# EAGLE design mini-in-a-1 (EAGLE 9.6.2)
AUTHOR: Balazs Racz; DRAWING_TITLE: I/O daughterboard; LICENSE: Licensed by the Solderpad Hardware License V2.0; REVIEWER: n/a; REVISION: A; YEAR: 2023
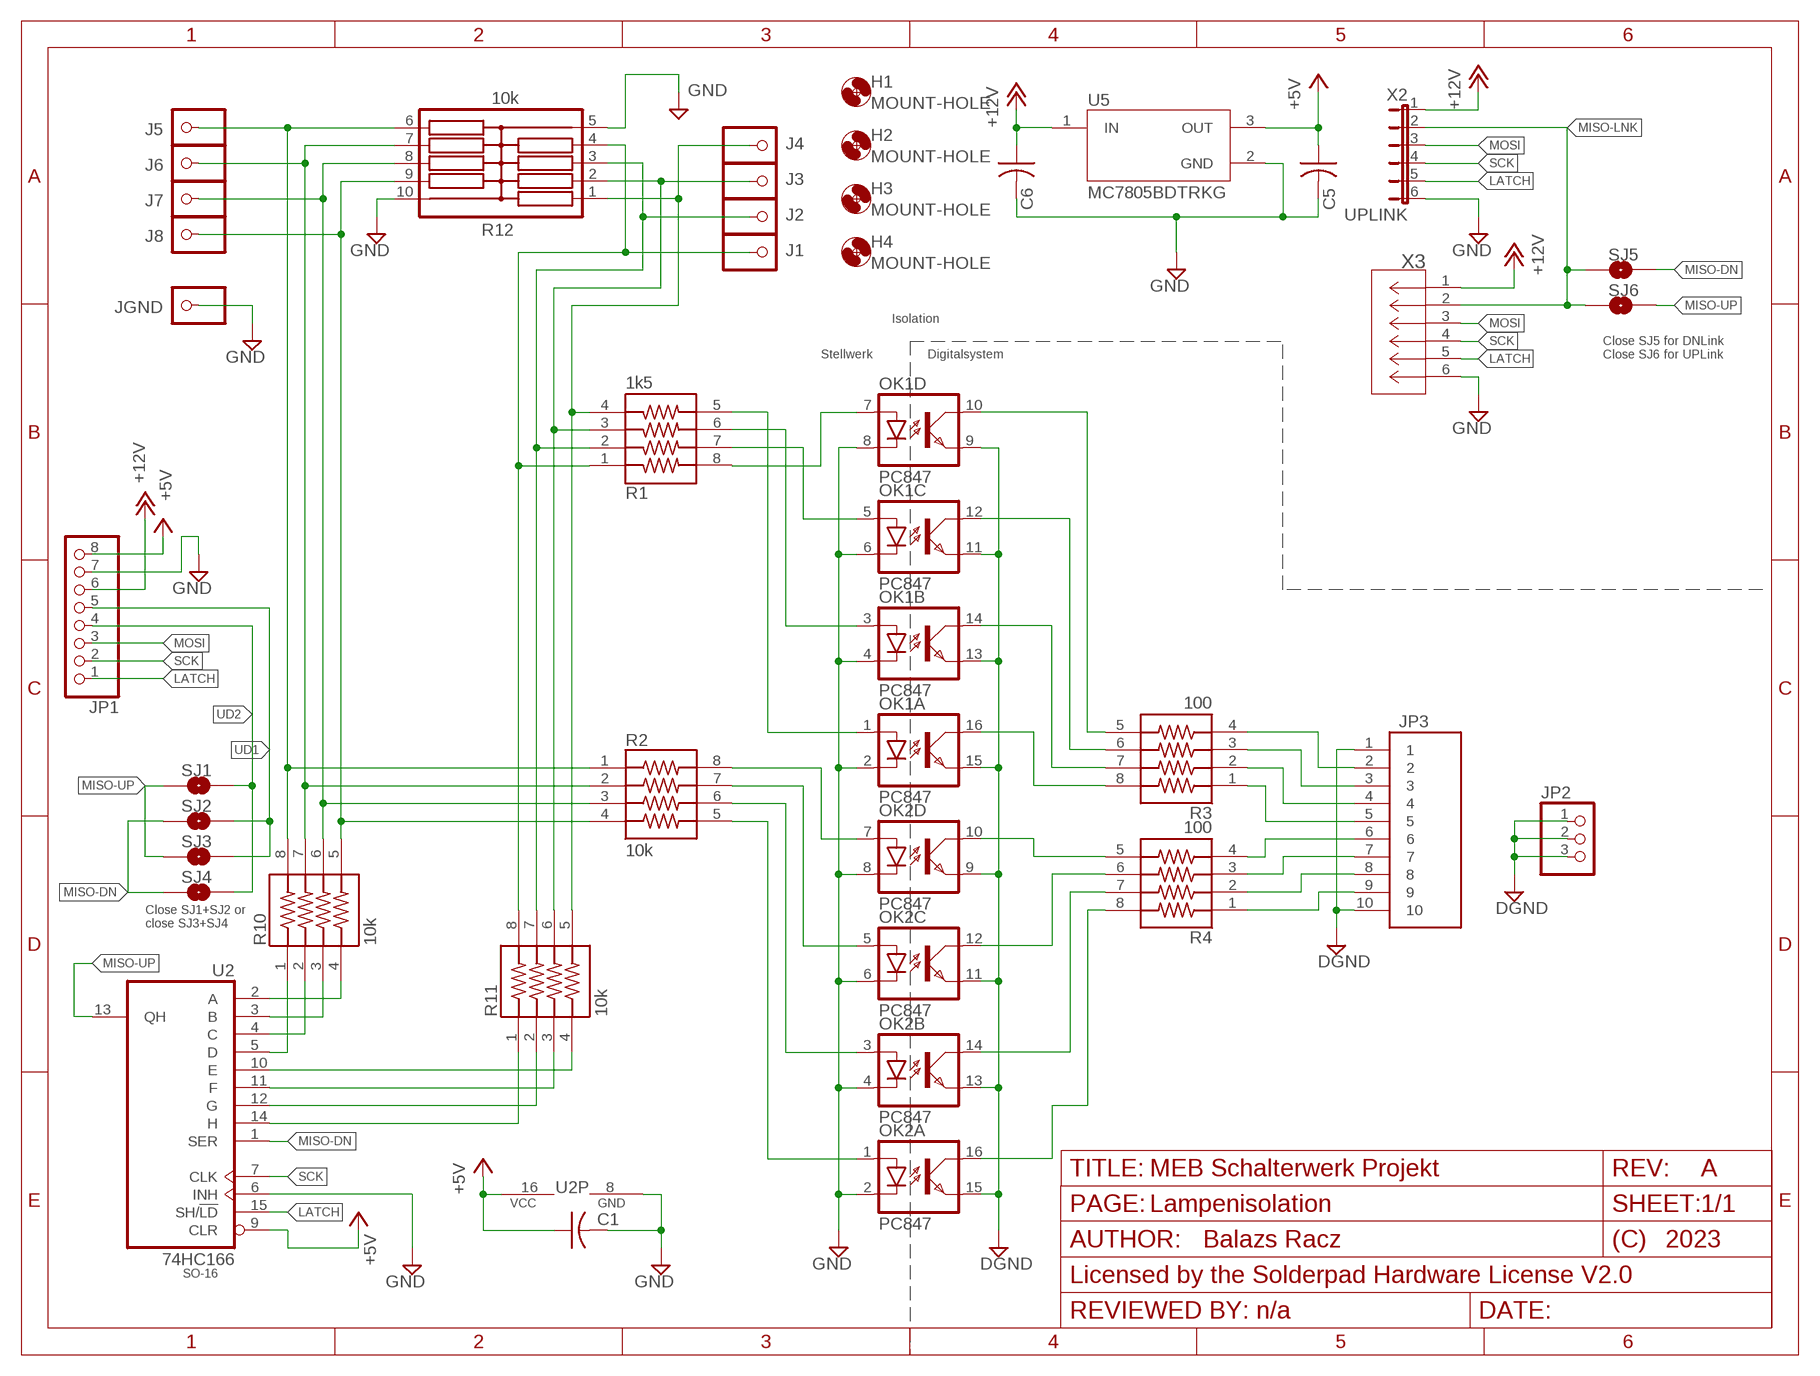
[diagram p0: schematic, sheet 1]
FRAME1 (FRAME_A_L): DRAWING_TITLE: MEB Schalterwerk Projekt; PAGE: Lampenisolation
FRAME2 (FRAME_A_L): PAGE: Input ports

## Parts
C1  C-USC0805  [C0805]
C5  C-USC0805  [C0805]
C6  C-USC0805  [C0805]
H1  MOUNT-HOLE  [MOUNT-HOLE-2,8]
H2  MOUNT-HOLE  [MOUNT-HOLE-2,8]
H3  MOUNT-HOLE  [MOUNT-HOLE-2,8]
H4  MOUNT-HOLE  [MOUNT-HOLE-2,8]
J1  LARGE-SOLDERPADWITH-HOLE  [LARGE-SOLDERPAD-WITH-HOLES]
J2  LARGE-SOLDERPADWITH-HOLE  [LARGE-SOLDERPAD-WITH-HOLES]
J3  LARGE-SOLDERPADWITH-HOLE  [LARGE-SOLDERPAD-WITH-HOLES]
J4  LARGE-SOLDERPADWITH-HOLE  [LARGE-SOLDERPAD-WITH-HOLES]
J5  LARGE-SOLDERPADWITH-HOLE  [LARGE-SOLDERPAD-WITH-HOLES]
J6  LARGE-SOLDERPADWITH-HOLE  [LARGE-SOLDERPAD-WITH-HOLES]
J7  LARGE-SOLDERPADWITH-HOLE  [LARGE-SOLDERPAD-WITH-HOLES]
J8  LARGE-SOLDERPADWITH-HOLE  [LARGE-SOLDERPAD-WITH-HOLES]
JGND  LARGE-SOLDERPADWITH-HOLE  [LARGE-SOLDERPAD-WITH-HOLES]
JP1  PINHD-1X8  [1X08]
JP2  PINHD-1X3  [1X03]
JP3  TE-CON-MTA150-RA-HEADER-1-640457-0  [TE_1-640457-0]
OK1  PC847  [DIL16]
OK2  PC847  [DIL16]
R1  1k5  RES-NET-YC324-JK-0710KL  [RESCAXS127P508X320X70-8N]
R2  10k  RES-NET-YC324-JK-0710KL  [RESCAXS127P508X320X70-8N]
R3  100  RES-NET-YC324-JK-0710KL  [RESCAXS127P508X320X70-8N]
R4  100  RES-NET-YC324-JK-0710KL  [RESCAXS127P508X320X70-8N]
R10  10k  RES-NET-YC324-JK-0710KL  [RESCAXS127P508X320X70-8N]
R11  10k  RES-NET-YC324-JK-0710KL  [RESCAXS127P508X320X70-8N]
R12  10k  RES-NET-745C101103JP  [RESCAV127P640X310X70-10N]
SJ1  SJRND2  [SJ_RND2]
SJ2  SJRND2  [SJ_RND2]
SJ3  SJRND2  [SJ_RND2]
SJ4  SJRND2  [SJ_RND2]
SJ5  SJRND2  [SJ_RND2]
SJ6  SJRND2  [SJ_RND2]
U2  74HC166  74166D  [SO16]
U5  MC7805BDTRKG  [DPAK229P990X238-4N]
X2  UPLINK  JP6-FLATFEMALE  [JP6F-FEM]
X3  MOLEX_530480610CON_530480610_MOL  [CON_530480610_MOL]

## Nets
+5V: C1.1 C5.1 JP1.8 U2.9(CLR) U2.16(VCC) U5.3(OUT)
+12V: C6.1 JP1.6 U5.1(IN) X2.1 X3.1
DGND: JP2.1 JP2.2 JP2.3 JP3.1 JP3.10 OK1.9(D:EMIT) OK1.11(C:EMIT) OK1.13(B:EMIT) OK1.15(A:EMIT) OK2.9(D:EMIT) OK2.11(C:EMIT) OK2.13(B:EMIT) OK2.15(A:EMIT)
GND: C1.2 C5.2 C6.2 JGND.P$1 JP1.7 OK1.2(A:C) OK1.4(B:C) OK1.6(C:C) OK1.8(D:C) OK2.2(A:C) OK2.4(B:C) OK2.6(C:C) OK2.8(D:C) R12.5 R12.10 U2.6(INH) U2.8(GND) U5.2(GND) X2.6 X3.6
LATCH: JP1.1 U2.15(SH/!LD) X2.5 X3.5
MISO-DN: SJ2.P$1 SJ4.P$1 SJ5.P$1 U2.1(SER)
MISO-LNK: SJ5.P$2 SJ6.P$2 X2.2 X3.2
MISO-UP: SJ1.P$1 SJ3.P$1 SJ6.P$1 U2.13(QH)
MOSI: JP1.3 X2.3 X3.3
N$1: J1.P$1 R1.1 R11.8 R12.4
N$2: J2.P$1 R1.2 R11.7 R12.3
N$3: J3.P$1 R1.3 R11.6 R12.2
N$4: J4.P$1 R1.4 R11.5 R12.1
N$5: J5.P$1 R2.1 R10.8 R12.6
N$6: J6.P$1 R2.2 R10.7 R12.7
N$7: J7.P$1 R2.3 R10.6 R12.8
N$8: J8.P$1 R2.4 R10.5 R12.9
N$9: OK1.7(D:A) R1.8
N$10: OK1.5(C:A) R1.7
N$11: OK1.3(B:A) R1.6
N$12: OK1.1(A:A) R1.5
N$15: JP3.2 R3.4
N$16: JP3.3 R3.3
N$17: JP3.4 R3.2
N$18: JP3.5 R3.1
N$19: JP3.6 R4.4
N$20: JP3.7 R4.3
N$21: JP3.8 R4.2
N$22: JP3.9 R4.1
N$23: OK1.10(D:COL) R3.5
N$24: OK1.12(C:COL) R3.6
N$25: OK1.14(B:COL) R3.7
N$26: OK1.16(A:COL) R3.8
N$27: OK2.10(D:COL) R4.5
N$28: OK2.12(C:COL) R4.6
N$29: OK2.14(B:COL) R4.7
N$30: OK2.16(A:COL) R4.8
N$31: OK2.7(D:A) R2.8
N$32: OK2.5(C:A) R2.7
N$33: OK2.3(B:A) R2.6
N$34: OK2.1(A:A) R2.5
QA: R10.4 U2.2(A)
QB: R10.3 U2.3(B)
QC: R10.2 U2.4(C)
QD: R10.1 U2.5(D)
QE: R11.4 U2.10(E)
QF: R11.3 U2.11(F)
QG: R11.2 U2.12(G)
QH: R11.1 U2.14(H)
SCK: JP1.2 U2.7(CLK) X2.4 X3.4
UD1: JP1.5 SJ2.P$2 SJ3.P$2
UD2: JP1.4 SJ1.P$2 SJ4.P$2

## Notes on the sheet
- Isolation
- Stellwerk | Digitalsystem
- Close SJ5 for DNLink
  Close SJ6 for UPLink
- Close SJ1+SJ2 or
  close SJ3+SJ4
- SO-16

## Library data of the parts
C1 C5 C6 = rcl:C-US: CAPACITOR, American symbol; SPICEPREFIX: C
H1-H4 = eagleparts:MOUNT-HOLE
J1-J8 JGND = eagleparts:LARGE-SOLDERPAD
JP1 = pinhead:PINHD-1X8: PIN HEADER
JP2 = pinhead:PINHD-1X3: PIN HEADER
JP3 = eagleparts:TE-CON-MTA150-RA-HEADER-1-640457-0: Connector Header Through Hole, Right Angle 10 position 0.100" (2.54mm) A1930-ND TE Connectivity AMP 1-640457-0; MANUFACTURER: TE; PARTREV: R; STANDARD: Manufacturer Recommendations
OK1 OK2 = optocoupler:PC847: SHARP OPTO COUPLER; OC_FARNELL: 9707735; OC_NEWARK: unknown
R1-R4 R10 R11 = eagleparts:RES-NET-YC324-JK-0710KL; MANUFACTURER: Yageo; MAXIMUM_PACKAGE_HEIGHT: 0.7 mm; PARTREV: V.9; SNAPEDA_PACKAGE_ID: 22941; STANDARD: IPC 7351B
R12 = eagleparts:RES-NET-745C101103JP: Res Thick Film Array 1K Ohm 5% 1/2W Â±200ppm/Â°C BUS Molded 10-Pin 2512 Concave SMD Plastic T/R; MANUFACTURER: CTS; PARTREV: K; STANDARD: IPC-7351B
SJ1-SJ6 = eagleparts:SJ: SMD solder JUMPER
U2 = trainlib:74*166: 8-bit parallel load SHIFT REGISTER
U5 = MC7805BDTRKG:MC7805BDTRKG: Linear Voltage Regulator, Positive, 5.0 V, 1.0 A Vout: 5.0 V; TJ = -40°C to +125°C; MANUFACTURER: ON Semiconductor; PARTREV: 27; STANDARD: IPC-7351B
X2 = eagleparts:JP6-FLAT
X3 = eagleparts:MOLEX_530480610: Right-angle 6-pin 1.25mm male molex connector. WM1746-ND https://www.digikey.com/en/products/detail/molex/0530480610/242868; COPYRIGHT: Copyright (C) 2023 Ultra Librarian. All rights reserved.; MANUFACTURER_PART_NUMBER: 530480610; MFR_NAME: Molex Connector Corporation

## Board
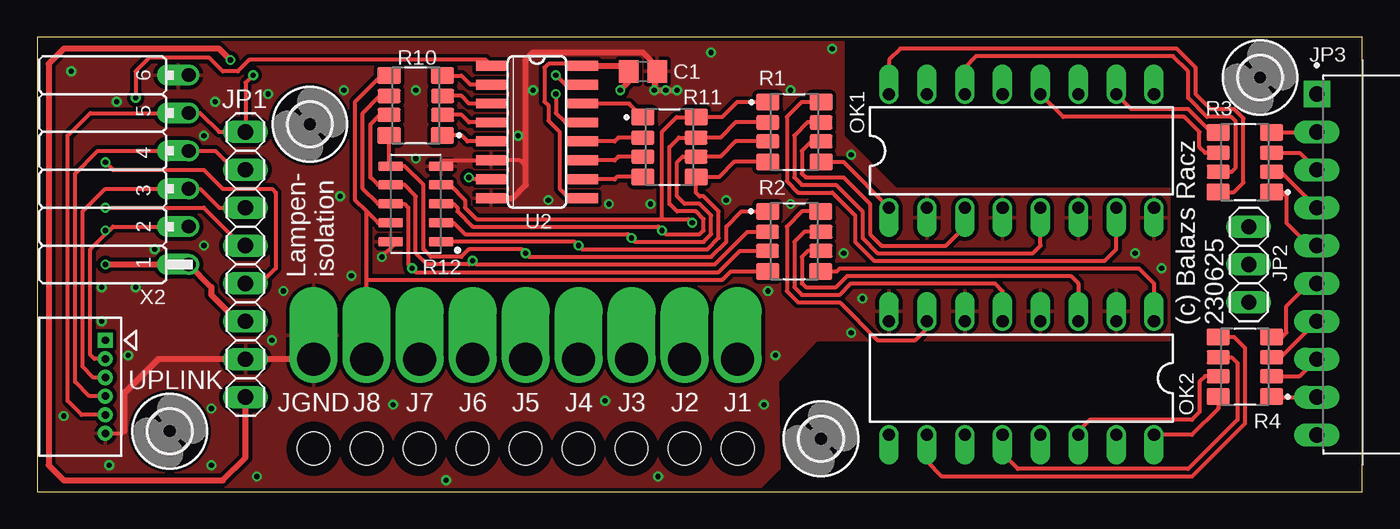
[diagram p1: board, top side]
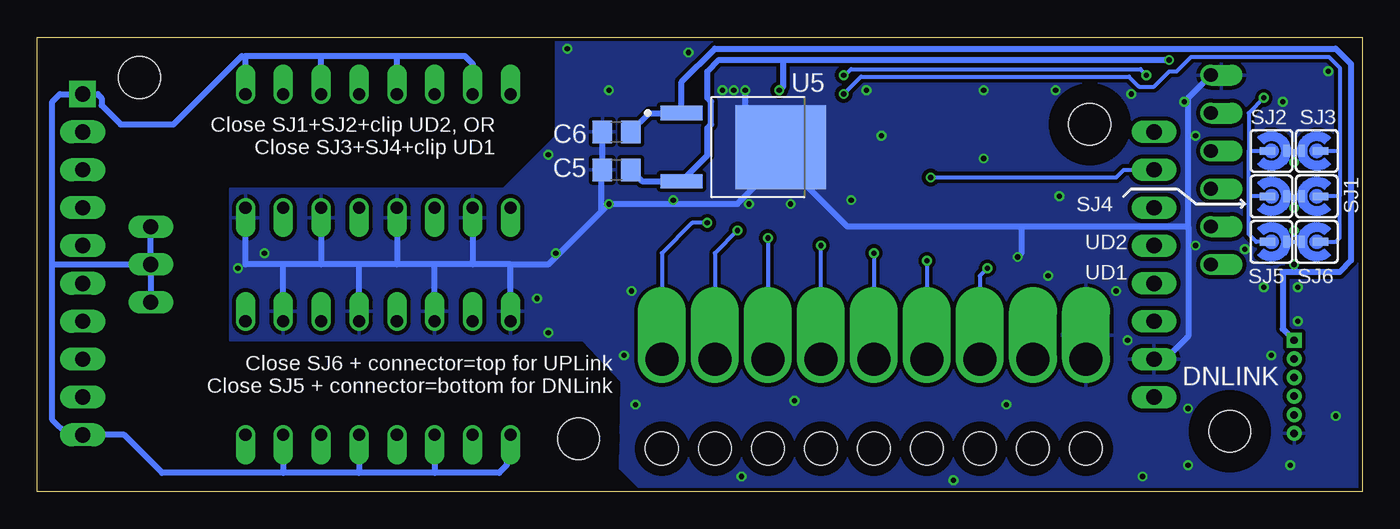
[diagram p2: board, bottom side, seen from below]

Size 88.9 x 30.48 mm. Coordinates in mm from the lower left corner, seen from the top.
Outline: 0,0 88.9,0 88.9,30.48 0,30.47 0,0
Copper layers (1*16): Top 0.035mm / dielectric 1.5mm / Bottom 0.035mm
Design rules "SeeedStudio_2layer_DRU_no_angle_20140221": minimum track width 6mil, minimum drill 12mil, track to track 6mil, track to pad 6mil, pad to pad 6mil, via to via 6mil, smd to smd 0mil, copper to edge 10mil, drill to drill 10mil, minimum pad ring 10mil, minimum via ring 6mil, stop-mask expansion 2mil, vias tented up to drill 100mil, thermal gap 10mil

### Footprints (pad centres in the part's own frame; a part is rotated, then mirrored left to right if it is on the bottom)
C0805 = smd 1.3 x 1.5: 1 -0.95,0; 2 0.95,0
MOUNT-HOLE-2,8 = hole 2.8: 0,0
LARGE-SOLDERPAD-WITH-HOLES = drill 2.2 pad 3 offset: P$1 0,0 | hole 2.2: 0,-6
1X08 = drill 1.016 long: 1 -8.89,0; 2 -6.35,0; 3 -3.81,0; 4 -1.27,0; 5 1.27,0; 6 3.81,0; 7 6.35,0; 8 8.89,0
1X03 = drill 1.016 long: 1 -2.54,0; 2 0,0; 3 2.54,0
TE_1-640457-0 = drill 1.02 pad 1.778 square: 1 -11.43,0 | drill 1.02 pad 1.37 long: 2 -8.89,0; 3 -6.35,0; 4 -3.81,0; 5 -1.27,0; 6 1.27,0; 7 3.81,0; 8 6.35,0; 9 8.89,0; 10 11.43,0
DIL16 = drill 0.813 offset: 1 -8.89,-3.81; 2 -6.35,-3.81; 3 -3.81,-3.81; 4 -1.27,-3.81; 5 1.27,-3.81; 6 3.81,-3.81; 7 6.35,-3.81; 8 8.89,-3.81; 9 8.89,3.81; 10 6.35,3.81; 11 3.81,3.81; 12 1.27,3.81; 13 -1.27,3.81; 14 -3.81,3.81; 15 -6.35,3.81; 16 -8.89,3.81
RESCAXS127P508X320X70-8N = smd 1.54 x 1.13: 1 -1.79,2.005; 4 -1.79,-2.005; 5 1.79,-2.005; 8 1.79,2.005 | smd 1.54 x 0.93: 2 -1.79,0.635; 3 -1.79,-0.635; 6 1.79,-0.635; 7 1.79,0.635
RESCAV127P640X310X70-10N = smd 1.63 x 0.63: 1 -1.695,2.54; 2 -1.695,1.27; 3 -1.695,0; 4 -1.695,-1.27; 5 -1.695,-2.54; 6 1.695,-2.54; 7 1.695,-1.27; 8 1.695,0; 9 1.695,1.27; 10 1.695,2.54
SJ_RND2 = smd 1.016 x 0.508: P$1 -0.254,0 | smd 0.406 x 0.813: P$2 1.016,0
SO16 = smd 0.66 x 2.032: 1 -4.445,-3.073; 2 -3.175,-3.073; 3 -1.905,-3.073; 4 -0.635,-3.073; 5 0.635,-3.073; 6 1.905,-3.073; 7 3.175,-3.073; 8 4.445,-3.073; 9 4.445,3.073; 10 3.175,3.073; 11 1.905,3.073; 12 0.635,3.073; 13 -0.635,3.073; 14 -1.905,3.073; 15 -3.175,3.073; 16 -4.445,3.073
DPAK229P990X238-4N = smd 0.97 x 2.83: 1 -2.29,-4.14; 3 2.29,-4.14 | smd 5.63 x 6.09: 2 0,2.51
JP6F-FEM = drill 0.914 offset: 1 -8.89,0; 2 -6.35,0; 3 -3.81,0; 4 -1.27,0; 5 1.27,0; 6 3.81,0
CON_530480610_MOL = drill 0.5 pad 0.85 square: 1 0,0 | drill 0.5 pad 0.85: 2 1.25,0; 3 2.5,0; 4 3.75,0; 5 5,0; 6 6.25,0

### Placement (x,y rotation side)
C1  40.64,28.19 0 top
C5  50.04,21.59 180 bottom
C6  50.04,24.13 180 bottom
H1  52.58,3.56 0 top
H2  82.04,27.79 0 top
H3  18.29,24.64 0 top
H4  8.89,4.06 0 top
J1  46.99,8.89 0 top
J2  43.43,8.89 0 top
J3  39.88,8.89 0 top
J4  36.32,8.89 0 top
J5  32.77,8.89 0 top
J6  29.21,8.89 0 top
J7  25.65,8.89 0 top
J8  22.1,8.89 0 top
JGND  18.54,8.89 0 top
JP1  13.97,15.24 270 top
JP2  81.28,15.24 270 top
JP3  85.85,15.24 270 top
OK1  66.04,22.86 0 top
OK2  66.04,7.62 180 top
R1  50.8,24.13 0 top
R2  50.79,16.79 0 top
R3  81.03,22.1 180 top
R4  81.03,8.38 180 top
R10  25.4,25.91 180 top
R11  42.42,23.11 0 top
R12  25.4,19.3 180 top
SJ1  3.05,19.81 180 bottom
SJ2  6.1,22.86 0 bottom
SJ3  3.05,22.86 180 bottom
SJ4  6.1,19.81 0 bottom
SJ5  6.1,16.76 0 bottom
SJ6  3.05,16.76 180 bottom
U2  33.53,24.13 270 top
U5  41.53,23.11 270 bottom
X2  10.16,24.13 90 top
X3  4.57,10.16 270 top

### Tracks (layer width: path | path; a pad name or v marks a point on that pad's centre or on a via)
+5V  (via drill 0.35)
  Top 0.254: U2.16 35.69,28.57 35.56,28.7 34.29,28.7 34.04,28.45 34.04,26.16 34.29,25.91 34.29,24.89 35.05,24.13 35.05,20.32 35.69,19.68 U2.9
  Top 0.406: U2.16 39.31,28.57 39.62,28.26 | 39.62,28.26 C1.1 | v39.12,26.92 39.62,27.43 39.62,28.26 | v12.95,28.96 12.19,29.72 1.78,29.72 0.76,28.7 0.76,1.78 1.78,0.76 12.45,0.76 13.97,2.29 JP1.8
  Bottom 0.406: C5.1 48.33,20.83 U5.3 43.94,22.55 43.94,24.38 43.69,24.64 43.69,26.16 43.94,26.42 43.94,28.19 43.18,28.96 38.86,28.96 | 38.86,28.96 38.86,27.18 v39.12,26.92 | 38.86,28.96 v12.95,28.96
+12V  (via drill 0.35)
  Top 0.254: X2.1 9.91,15.24 | v4.57,15.24
  Top 0.406: v4.57,15.24 9.91,15.24 X2.1 11.68,13.72 11.68,13.21 13.46,11.43 JP1.6
  Bottom 0.254: v4.57,15.24 4.57,14.99
  Bottom 0.406: C6.1 47.82,25.4 U5.1 45.67,27.48 43.43,29.72 1.78,29.72 0.76,28.7 0.76,15.49 1.52,14.73 4.57,14.73 | 4.57,14.99 4.57,14.73 | X3.1 5.33,10.92 5.33,14.73 4.57,14.73
DGND
  Bottom 0.406: OK2.9 57.4,3.56 57.4,1.78 57.91,1.27 62.23,1.27 | 62.23,1.27 67.31,1.27 | 67.31,1.27 72.39,1.27 | 72.39,1.27 80.52,1.27 83.06,3.81 JP3.10 86.87,3.81 87.88,4.83 87.88,15.24 | OK2.15 72.39,1.27 | OK2.13 67.31,1.27 | OK2.11 62.23,1.27 | 87.88,15.24 87.88,26.16 87.38,26.67 JP3.1 84.84,26.67 84.75,26.58 84.75,26.57 84.58,26.4 84.58,25.91 83.31,24.64 79.76,24.64 75.18,29.21 74.93,29.21 | OK1.15 59.69,28.7 60.2,29.21 64.77,29.21 | 64.77,29.21 69.85,29.21 | 69.85,29.21 74.93,29.21 | OK1.13 64.77,29.21 | OK1.11 69.85,29.21 | OK1.9 74.93,29.21 | 87.88,15.24 JP2.2 | JP2.2 JP2.1 | JP2.2 JP2.3
GND  (via drill 0.35)
  Top 0.254: R12.5 27.28,22.23 U2.6 32.38,22.23 32.77,21.84 32.77,20.57 | X3.6 5.69,3.91 5.84,4.06 | R12.10 23.9,16.54 v23.11,15.75
  Top 0.406: U2.8 31.88,19.68 32.77,20.57 32.77,28.96 33.27,29.46 40.64,29.46 41.59,28.51 C1.2 41.4,28.01 v41.4,26.92 v42.16,26.92 v42.93,26.92 | JGND.P$1 JP1.7 8.13,8.89 5.84,6.6 5.84,4.06
  Bottom 0.254: v41.4,26.92
  Bottom 0.406: OK2.8 57.15,15.24 | 57.15,15.24 59.69,15.24 | 59.69,15.24 62.23,15.24 | 62.23,15.24 64.77,15.24 | 64.77,15.24 67.31,15.24 | 67.31,15.24 69.85,15.24 | 69.85,15.24 72.39,15.24 | 72.39,15.24 74.93,15.24 OK1.8 | OK1.6 69.85,15.24 | OK2.2 72.39,15.24 | OK1.4 64.77,15.24 | OK2.6 62.23,15.24 | OK2.4 67.31,15.24 | OK1.2 59.69,15.24 | 57.15,15.24 54.61,15.24 51.05,18.8 | 51.05,18.8 51.05,21.52 C5.2 C6.2 | 51.05,18.8 v50.55,19.3 41.91,19.3 39.02,22.2 39.02,22.25 | v41.4,26.92 41.4,25.5 U5.2 39.02,22.25 | X2.6 11.68,26.42 11.68,17.78 | 11.68,17.78 22.86,17.78 | 22.86,17.78 34.54,17.78 39.02,22.25 | 22.86,17.78 22.86,16 v23.11,15.75 | JP1.7 13.21,8.89 11.68,10.41 11.68,17.78
  other vias: 20.32,19.81 21.08,14.48 16.51,13.46 15.75,10.16 6.6,13.72 6.1,9.14 11.68,5.59 11.68,1.78 14.73,1.02 27.43,0.76 41.66,1.02 48.77,5.84 49.53,9.14 54.61,10.67 55.37,12.95 54.1,16 49.02,13.46 46.23,19.56 38.35,19.3 41.15,19.3 34.29,19.56 32.26,23.88 33.27,26.92 45.21,29.46 50.55,26.92 53.34,29.72 54.61,22.61 73.66,16 75.44,14.99 2.29,28.19 5.33,26.16 11.94,26.16 11.18,23.88 11.18,16.51 7.87,16.26 1.78,5.08 4.83,1.78 25.4,22.35 25.4,26.92 20.57,26.92 15.49,26.67 38.1,6.1 23.88,5.84 4.32,13.72 4.32,11.43
  pour Top (isolate 0.254): 0.25,30.23 0.25,0.25 48.51,0.25 49.78,1.52 49.7,7.38 52.32,10.16 75.95,10.16 75.95,20.32 57.66,20.32 54.1,23.88 54.1,30.23
  pour Bottom (isolate 0.254): 0.25,30.23 0.25,0.25 48.51,0.25 49.78,1.52 49.7,7.38 52.32,10.16 75.95,10.16 75.95,20.32 57.66,20.32 54.1,23.88 54.1,30.23
  pour Bottom (rank 2, no thermals): 35.56,26.67 35.56,26.16 35.05,25.65 35.05,19.81 42.67,19.81 42.67,26.42 39.62,26.42 39.37,26.16 38.86,26.16 38.61,26.42 38.35,26.67
LATCH  (via drill 0.35)
  Top 0.254: X3.5 2.97,5.16 2.03,6.1 2.03,23.88 3.56,25.4 X2.5 10.92,25.4 12.19,24.13 JP1.1 13.97,27.43 v14.48,27.94 | U2.15 35.43,27.3 v34.8,27.94
  Bottom 0.254: v34.8,27.94 34.7,27.94 34.29,28.35 14.88,28.35 v14.48,27.94
MISO-DN  (via drill 0.35)
  Top 0.254: U2.1 30.07,28.96 14.22,28.96 13.46,28.19 12.45,28.19 11.53,29.11 7.52,29.11 6.6,28.19 v6.6,26.42
  Bottom 0.254: SJ5.P$1 7.11,16.76 7.62,17.27 7.62,19.81 | 7.62,19.81 7.62,22.86 | 7.62,22.86 SJ2.P$1 | SJ4.P$1 7.62,19.81 | v6.6,26.42 7.62,25.4 7.62,22.86
MISO-LNK  (via drill 0.35)
  Top 0.254: X3.2 3.83,8.91 3.56,9.18 3.56,16.26 4.57,17.27 | X2.2 5.08,17.78 4.57,17.27 | v4.57,17.53 4.57,17.27
  Bottom 0.254: SJ5.P$2 SJ6.P$2 4.57,17.27 v4.57,17.53
MISO-UP  (via drill 0.35)
  Top 0.254: U2.13 35.43,24.77 34.8,25.4 v34.8,26.67
  Bottom 0.254: SJ6.P$1 1.78,16.76 1.52,17.02 1.52,19.81 | 1.52,22.86 1.52,19.81 | v34.8,26.67 33.63,27.84 15.65,27.84 14.99,27.18 13.97,27.18 12.95,28.19 12.45,28.19 11.48,29.16 2.23,29.16 1.52,28.45 1.52,22.86 | 1.52,19.81 SJ1.P$1 | SJ3.P$1 1.52,22.86
MOSI
  Top 0.254: JP1.3 12.19,19.05 10.92,20.32 X2.3 4.57,20.32 3.05,18.8 3.05,8.38 3.77,7.66 X3.3
N$1  (via drill 0.35)
  Top 0.254: R12.4 27.69,20.57 28.7,19.56 28.7,19.05 29.46,18.29 41.91,18.29 | v43.94,18.03 43.69,18.29 41.91,18.29 | 41.91,18.29 41.91,24.13 42.9,25.12 R11.8 45.95,25.12 46.96,26.14 R1.1
  Bottom 0.254: v43.94,18.03 44.96,18.03 46.99,16 J1.P$1
N$2  (via drill 0.35)
  Top 0.254: R12.3 27.94,19.3 28.19,19.05 28.19,18.8 29.21,17.78 41.66,17.78 v41.91,17.53 42.16,17.27 44.45,17.27 44.7,17.53 44.7,18.29 44.2,18.8 42.93,18.8 42.42,19.3 42.42,23.11 43.05,23.75 R11.7 45.85,23.75 46.86,24.77 R1.2
  Bottom 0.254: v41.91,17.53 43.43,16 J2.P$1
N$3  (via drill 0.35)
  Top 0.254: R12.2 27.94,18.03 28.7,17.27 39.62,17.27 v39.88,17.02 40.13,16.76 44.7,16.76 45.21,17.27 45.21,18.54 44.45,19.3 43.43,19.3 42.93,19.81 42.93,22.1 43.31,22.48 R11.6 45.85,22.48 46.86,23.5 R1.3
  Bottom 0.254: v39.88,17.02 J3.P$1
N$4  (via drill 0.35)
  Top 0.254: R12.1 36.07,16.76 v36.32,16.51 36.58,16.26 44.96,16.26 45.72,17.02 45.72,18.8 44.7,19.81 44.45,19.81 44.2,20.07 44.2,21.1 | 44.2,21.1 R11.5 | R1.4 46.76,22.12 45.73,21.1 44.2,21.1
  Bottom 0.254: J4.P$1 v36.32,16.51
N$5  (via drill 0.35)
  Top 0.254: R10.8 23.61,22.14 R12.6 24.64,21.84 25.91,20.57 25.91,16.26 26.42,15.75 28.45,15.75 28.96,16.26 32.51,16.26 v32.77,16 33.02,15.75 45.21,15.75 46.23,16.76 46.23,17.78 47.24,18.8 R2.1
  Bottom 0.254: v32.77,16 J5.P$1
N$6  (via drill 0.35)
  Top 0.254: R10.7 22.99,25.27 22.35,24.64 22.35,21.08 22.86,20.57 R12.7 24.64,20.57 25.4,19.81 25.4,16 26.16,15.24 28.96,15.24 v29.21,15.49 29.46,15.24 45.47,15.24 47.65,17.43 R2.2
  Bottom 0.254: v29.21,15.49 J6.P$1
N$7  (via drill 0.35)
  Top 0.254: R10.6 22.99,26.54 21.84,25.4 21.84,20.32 22.86,19.3 R12.8 24.64,19.3 24.89,19.05 24.89,15.24 v25.15,14.99 25.4,14.73 45.72,14.73 47.14,16.16 R2.3
  Bottom 0.254: v25.15,14.99 25.65,14.48 J7.P$1
N$8
  Top 0.254: J8.P$1 22.1,14.22 | 22.1,14.22 22.1,18.8 | R12.9 22.86,18.03 22.1,18.8 | 22.1,18.8 21.34,19.56 21.34,26.16 23.09,27.91 R10.5 | 22.1,14.22 45.97,14.22 46.54,14.79 R2.4
N$9
  Top 0.254: R1.8 51.28,26.14 50.29,25.15 50.29,20.83 51.05,20.07 53.34,20.07 54.86,18.54 54.86,16.76 56.13,15.49 71.63,15.49 72.39,16.26 OK1.7
N$10
  Top 0.254: R1.7 51.69,24.77 50.8,23.88 50.8,21.08 51.31,20.57 53.59,20.57 55.37,18.8 55.37,17.02 56.39,16 66.8,16 67.31,16.51 OK1.5
N$11
  Top 0.254: R1.6 51.94,23.5 51.31,22.86 51.31,21.34 51.56,21.08 54.1,21.08 55.88,19.3 55.88,17.27 56.64,16.51 60.96,16.51 62.23,17.78 OK1.3
N$12
  Top 0.254: R1.5 54.07,22.12 OK1.1
N$15
  Top 0.254: R3.4 85.83,24.1 JP3.2
N$16
  Top 0.254: R3.3 84.71,22.73 JP3.3
N$17
  Top 0.254: R3.2 83.44,21.46 JP3.4
N$18
  Top 0.254: R3.1 83.54,20.09 83.82,19.81 83.82,18.03 85.34,16.51 JP3.5
N$19
  Top 0.254: R4.4 83.54,10.39 83.82,10.67 83.82,12.45 85.34,13.97 JP3.6
N$20
  Top 0.254: R4.3 83.44,9.02 JP3.7
N$21
  Top 0.254: R4.2 84.71,7.75 JP3.8
N$22
  Top 0.254: 82.84,6.35 JP3.9
  Top 0.406: R4.1 82.84,6.35
N$23
  Top 0.254: OK1.10 73.41,25.65 77.22,25.65 78.77,24.1 R3.5
N$24
  Top 0.254: R3.6 78.36,22.73 77.98,23.11 77.98,24.13 76.96,25.15 68.83,25.15 OK1.12
N$25
  Top 0.254: R3.7 80.14,21.46 80.42,21.74 80.42,24.84 80.11,25.15 78.49,25.15 77.22,26.42 77.22,28.19 76.2,29.21 62.99,29.21 62.23,28.45 OK1.14
N$26
  Top 0.254: R3.8 80.29,20.09 80.92,20.73 80.92,25.04 80.32,25.65 78.74,25.65 77.72,26.67 77.72,28.45 76.45,29.72 57.91,29.72 57.15,28.96 OK1.16
N$27
  Top 0.254: R4.5 80.29,10.39 81.03,9.65 81.03,4.57 77.47,1.02 60.71,1.02 59.69,2.03 OK2.10
N$28
  Top 0.254: R4.6 80.14,9.02 80.52,8.64 80.52,4.83 77.22,1.52 65.79,1.52 64.77,2.54 OK2.12
N$29
  Top 0.254: OK2.14 69.85,4.06 70.61,4.83 77.47,4.83 77.98,5.33 77.98,7.37 78.36,7.75 R4.7
N$30
  Top 0.254: R4.8 79.24,5.58 77.47,3.81 OK2.16
N$31
  Top 0.254: R2.8 51.31,18.8 50.29,17.78 50.29,13.46 51.05,12.7 53.85,12.7 56.39,10.16 58.93,10.16 59.69,10.92 OK2.7
N$32
  Top 0.254: R2.7 51.46,17.43 50.8,16.76 50.8,13.72 51.31,13.21 53.85,13.21 54.61,13.97 64.26,13.97 64.77,13.46 OK2.5
N$33
  Top 0.254: R2.6 51.72,16.16 51.31,15.75 51.31,13.97 51.56,13.72 53.59,13.72 54.36,14.48 69.34,14.48 69.85,13.97 OK2.3
N$34
  Top 0.254: R2.5 53.65,14.79 53.85,14.99 73.91,14.99 74.93,13.97 OK2.1
QA
  Top 0.254: R10.4 28.46,27.91 29.07,27.3 U2.2
QB
  Top 0.254: U2.3 28.97,26.04 28.46,26.54 R10.3
QC
  Top 0.254: U2.4 28.97,24.77 28.46,25.27 R10.2
QD
  Top 0.254: U2.5 28.87,23.5 28.46,23.9 R10.1
QE
  Top 0.254: R11.4 38.89,21.11 38.73,20.95 U2.10
QF
  Top 0.254: R11.3 38.99,22.48 38.73,22.23 U2.11
QG
  Top 0.254: R11.2 38.99,23.75 38.73,23.5 U2.12
QH
  Top 0.254: R11.1 39.71,26.04 U2.14
SCK  (via drill 0.35)
  Top 0.254: JP1.2 13.21,21.59 11.94,22.86 X2.4 4.06,22.86 2.54,21.34 2.54,7.37 3.5,6.41 X3.4 | U2.7 29.08,20.95 v28.96,21.08
  Bottom 0.254: JP1.2 16,21.59 16.51,21.08 v28.96,21.08
UD1  (via drill 0.35)
  Top 0.254: v4.57,22.1 5.08,21.59 11.18,21.59 12.45,20.32 15.75,20.32 16,20.07 16,14.99 14.99,13.97 JP1.5
  Bottom 0.254: SJ2.P$2 4.57,22.86 | 4.57,22.86 SJ3.P$2 | 4.57,22.86 v4.57,22.1
UD2  (via drill 0.35)
  Top 0.254: JP1.4 13.72,16.51 11.18,19.05 v4.57,19.05
  Bottom 0.254: SJ4.P$2 4.57,19.81 | 4.57,19.81 SJ1.P$2 | 4.57,19.81 v4.57,19.05

### Text on the board
tNames: Lampen- / isolation | (c) Balazs Racz / 230625 | UPLINK
bNames: Close SJ1+SJ2+clip UD2, OR / Close SJ3+SJ4+clip UD1 | UD2 | UD1 | Close SJ6 + connector=top for UPLink / Close SJ5 + connector=bottom for DNLink | DNLINK